# EAGLE design volt_boost (EAGLE 7.2.0)
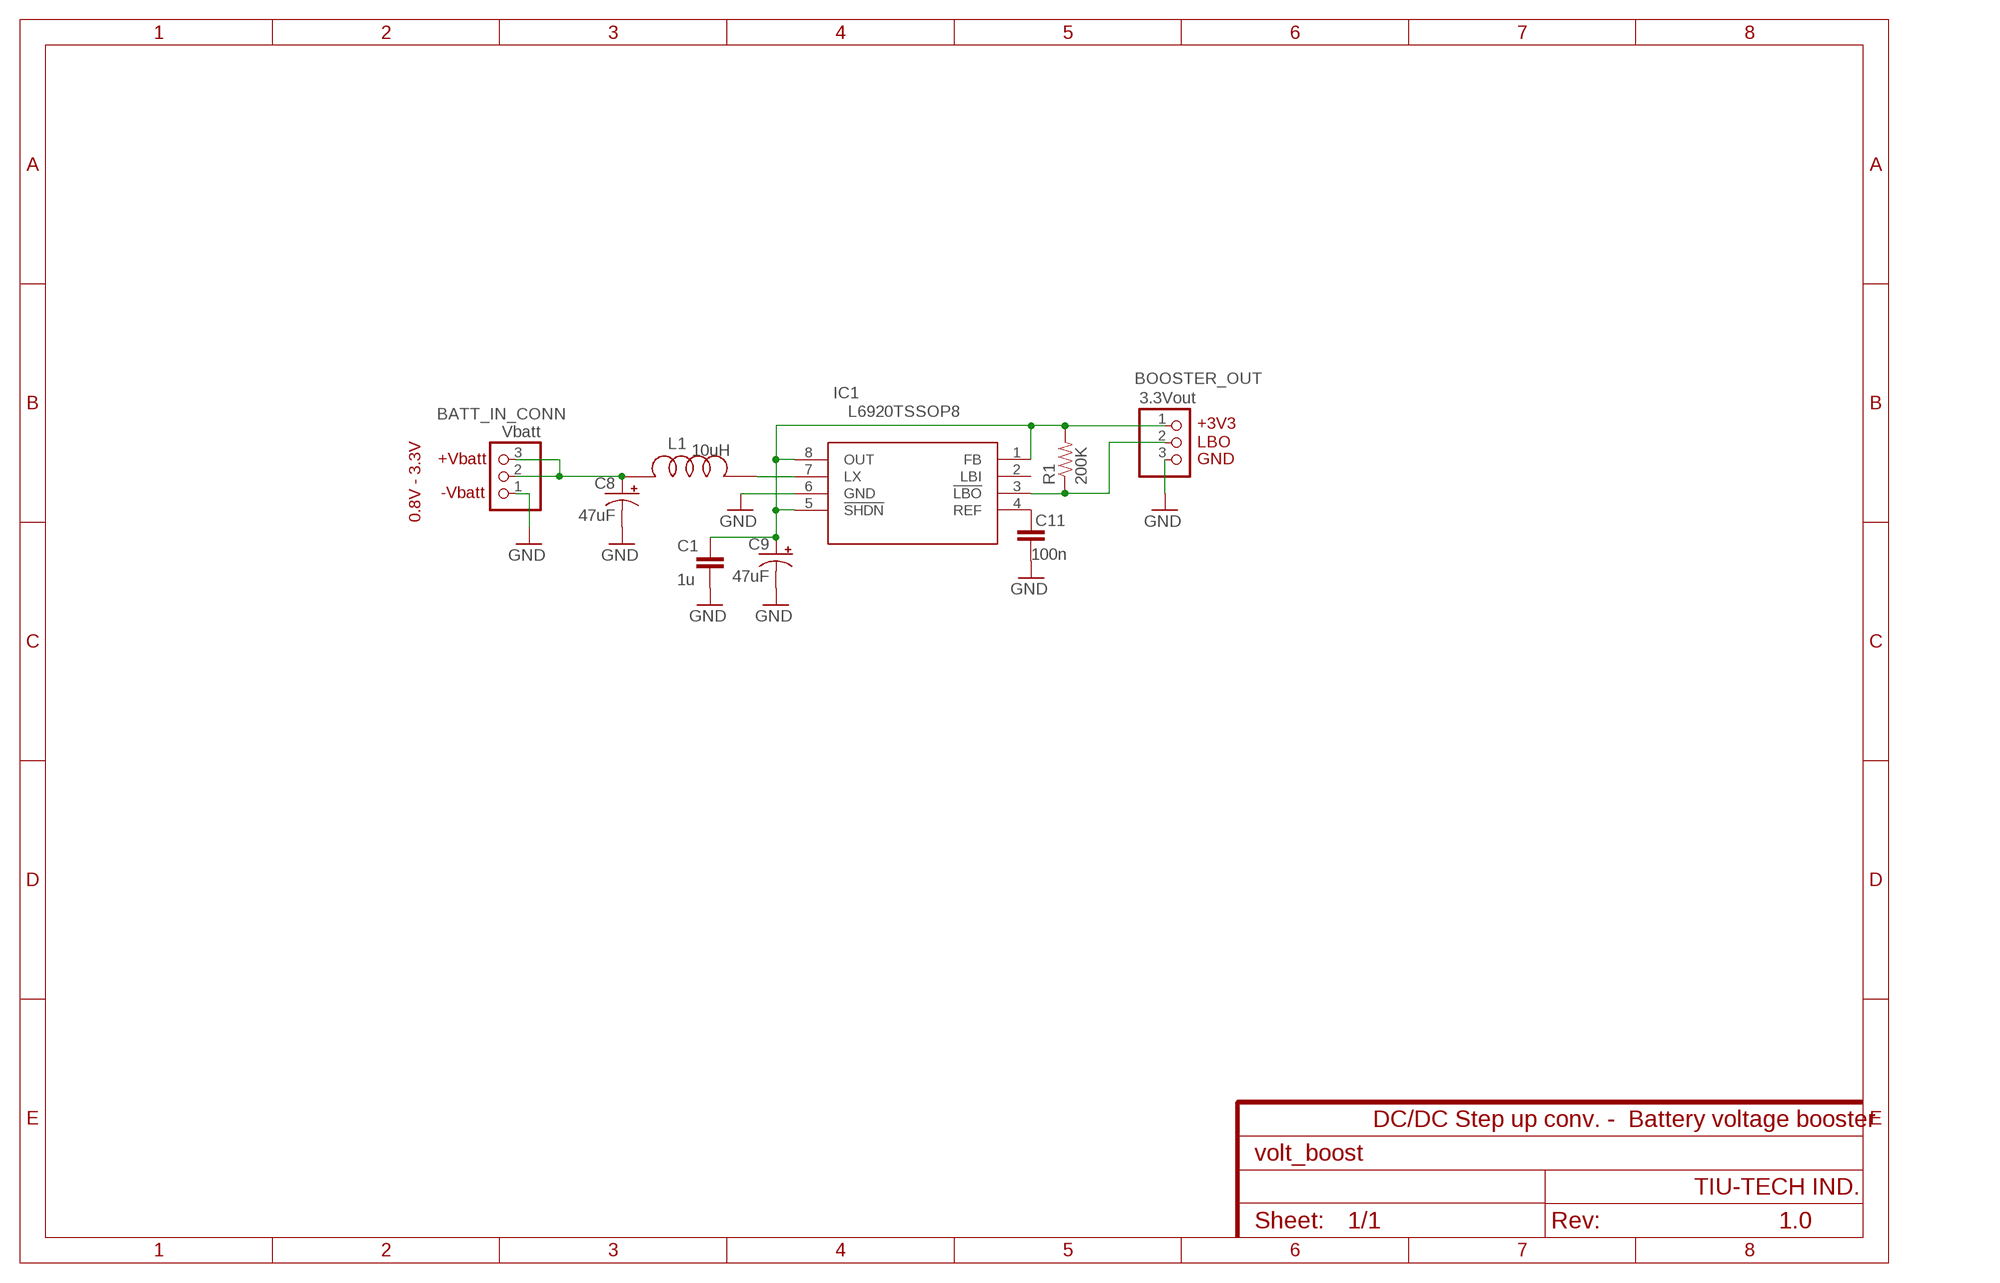
[diagram p0: schematic, sheet 1]

## Parts
BATT_IN_CONN  Vbatt  PINHD-1X3  [1X03]
BOOSTER_OUT  3.3Vout  PINHD-1X3  [1X03]
C1  1u  CAP0805  [0805]
C8  47uF  47UF-TANT  [EIA3528]
C9  47uF  47UF-TANT  [EIA3528]
C11  100n  CAP0805  [0805]
IC1  L6920TSSOP8  [TSSOP8]
L1  10uH  DLJ-4018  [DLJ-4018]
R1  200K  RESISTOR0805-RES  [0805]

## Nets
+3.3V: BOOSTER_OUT.1 C1.1 C9.A(+) IC1.1(FB) IC1.5(!SHDN) IC1.8(OUT) R1.2
GND: BATT_IN_CONN.1 BOOSTER_OUT.3 C1.2 C8.C(-) C9.C(-) C11.2 IC1.6(GND)
N$1: IC1.7(LX) L1.P$1
N$2: BATT_IN_CONN.2 BATT_IN_CONN.3 C8.A(+) L1.P$2
N$3: BOOSTER_OUT.2 IC1.3(!LBO) R1.1
N$4: C11.1 IC1.4(REF)
Unconnected: IC1.2(LBI)

## Notes on the sheet
- +3V3
- LBO
- +Vbatt | GND
- -Vbatt
- 0.8V - 3.3V
- DC/DC Step up conv. -  Battery voltage booster
- TIU-TECH IND.
- 1.0

## Library data of the parts
BATT_IN_CONN BOOSTER_OUT = pinhead:PINHD-1X3: PIN HEADER
C1 C11 = SparkFun-Capacitors:CAP: Capacitor Standard 0603 ceramic capacitor, and 0.1" leaded capacitor.
C8 C9 = SparkFun-Capacitors:47UF-TANT: 47uF Tantalum SMT CAP-08310- 10V 10% (EIA-3528); PROD_ID: CAP-08310
IC1 = l6920:L6920
L1 = dlj-4018:DLJ-4018
R1 = SparkFun-Resistors:RESISTOR: Resistor Basic schematic elements and footprints for 0603, 1206, and PTH resistors.

## Board
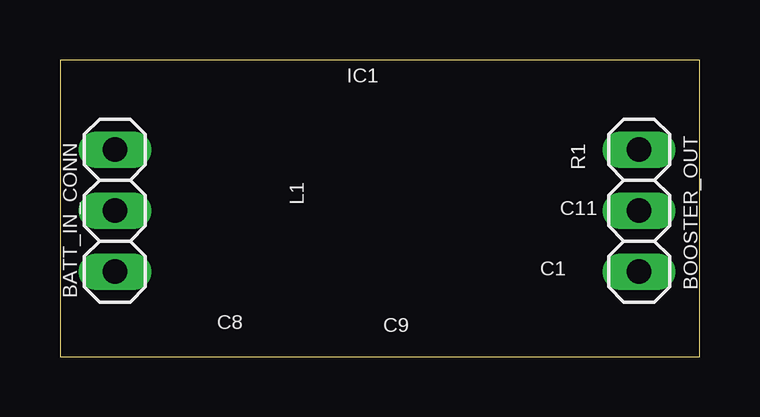
[diagram p1: board, top side]
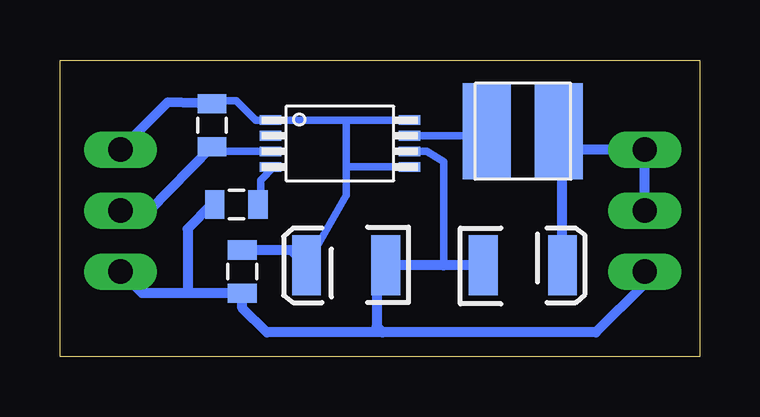
[diagram p2: board, bottom side, seen from below]

Size 26.65 x 12.37 mm. Coordinates in mm from the lower left corner, seen from the top.
Outline: 0,0 26.65,0 26.65,12.37 0,12.37 0,0
Copper layers (1*16): Top 0.035mm / dielectric 1.5mm / Bottom 0.035mm
Design rules "default": minimum track width 10mil, minimum drill 24mil, track to track 8mil, track to pad 8mil, pad to pad 8mil, via to via 8mil, smd to smd 8mil, copper to edge 40mil, drill to drill 8mil, minimum pad ring 10mil, minimum via ring 8mil, stop-mask expansion 4mil, vias tented up to drill 0mil, thermal gap 10mil

### Footprints (pad centres in the part's own frame; a part is rotated, then mirrored left to right if it is on the bottom)
1X03 = drill 1.016 long: 1 -2.54,0; 2 0,0; 3 2.54,0
0805 = smd 0.8 x 1.2: 1 -0.9,0; 2 0.9,0
EIA3528 = smd 1.2 x 2.5: A 1.65,0; C -1.65,0
TSSOP8 = smd 0.4 x 0.9: 1 -0.975,-2.9; 2 -0.325,-2.9; 3 0.325,-2.9; 4 0.975,-2.9; 5 0.975,2.9; 6 0.325,2.9; 7 -0.325,2.9; 8 -0.975,2.9
DLJ-4018 = smd 4 x 2: P$1 0,-1.5; P$2 0,1.5

### Placement (x,y rotation side)
BATT_IN_CONN  2.29,6.1 90 top
BOOSTER_OUT  24.13,6.1 270 top
C1  19.05,3.56 270 bottom
C8  7.37,3.81 0 bottom
C9  14.73,3.81 180 bottom
C11  19.3,6.35 180 bottom
IC1  14.99,8.89 270 bottom
L1  7.37,9.4 270 bottom
R1  20.32,9.65 90 bottom

### Tracks (layer width: path | path; a pad name or v marks a point on that pad's centre or on a via)
+3.3V
  Bottom 0.305: R1.2 20.2,10.67 19.3,10.67 18.5,9.87 IC1.1 14.73,9.87 | 14.73,9.87 14.73,7.92 | 14.73,7.92 14.73,6.73 C9.A | IC1.8 14.73,9.87 | IC1.5 14.73,7.92
  Bottom 0.406: R1.2 22.16,10.6 BOOSTER_OUT.1 | C1.1 17.03,4.46 C9.A
GND
  Bottom 0.305: IC1.6 11.36,8.57 10.67,8.13 10.67,3.81
  Bottom 0.406: 13.21,1.02 4.32,1.02 2.29,3.05 BATT_IN_CONN.1 | 13.21,1.02 18.03,1.02 19.05,2.03 C1.2 21.34,2.66 | C8.C 10.67,3.81 C9.C 13.46,4.19 13.46,1.27 13.21,1.02 | 21.34,2.66 23.23,2.66 BOOSTER_OUT.3 | C11.2 20.32,6.35 21.34,5.33 21.34,2.66
N$1
  Bottom 0.305: IC1.7 8.87,9.22 L1.P$1
N$2
  Bottom 0.406: C8.A 5.72,7.87 | 5.72,7.87 5.72,8.38 | 5.72,8.38 5.72,9.25 L1.P$2 | 5.46,7.62 5.72,7.87 | BATT_IN_CONN.2 BATT_IN_CONN.3 5.46,8.64 5.72,8.38
N$3
  Bottom 0.305: IC1.3 20.13,8.57 R1.1
  Bottom 0.406: 20.18,8.56 R1.1 22.93,6.1 BOOSTER_OUT.2
N$4
  Bottom 0.305: IC1.4 17.74,7.92 18.29,7.37 18.29,6.47 C11.1